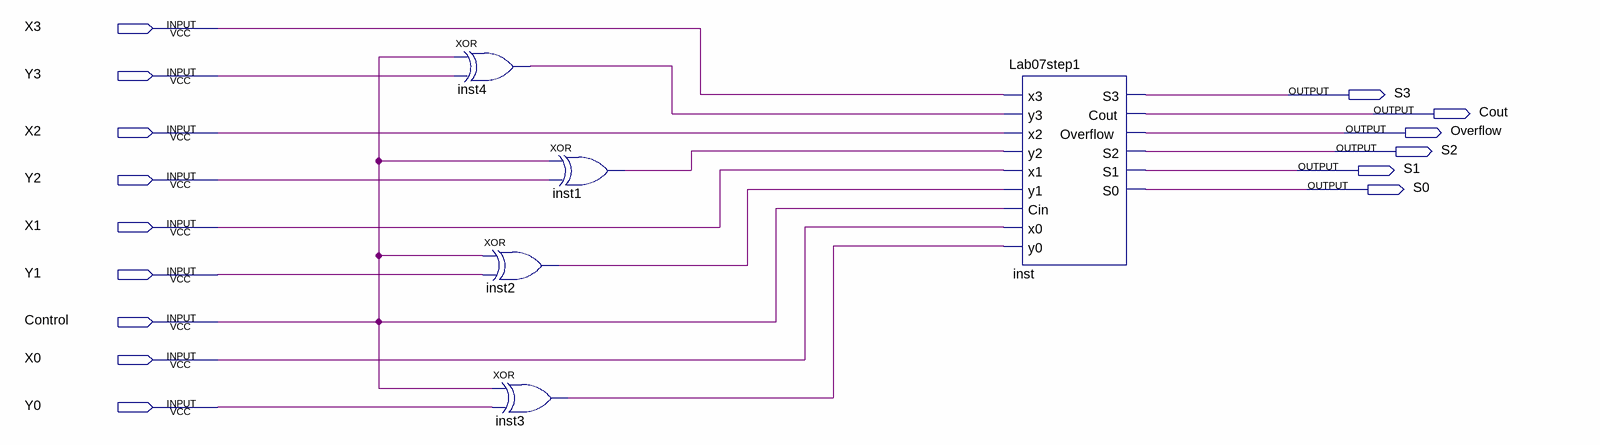
[diagram p0: schematic sheet]
// Quartus schematic Lab07step2.bdf as structural Verilog: 5 symbols, 15 pins
module Lab07step2 (
  input  X3,
  input  Y3,
  input  X2,
  input  Y2,
  input  X1,
  input  Y1,
  input  Control,
  input  X0,
  input  Y0,
  output S3,
  output Cout,
  output Overflow,
  output S2,
  output S1,
  output S0
);

  wire inst1_out, inst2_out, inst3_out, inst4_out;

  xor inst4 (inst4_out, Control, Y3);
  xor inst1 (inst1_out, Control, Y2);
  xor inst2 (inst2_out, Control, Y1);
  xor inst3 (inst3_out, Control, Y0);
  Lab07step1 inst (
    .x3(X3), .y3(inst4_out), .x2(X2), .y2(inst1_out), .x1(X1), .y1(inst2_out), .Cin(Control), .x0(X0),
    .y0(inst3_out), .S3(S3), .Cout(Cout), .Overflow(Overflow), .S2(S2), .S1(S1), .S0(S0));
endmodule
